# EAGLE design ble113_breakout_board_v20 (EAGLE 7.7.0)
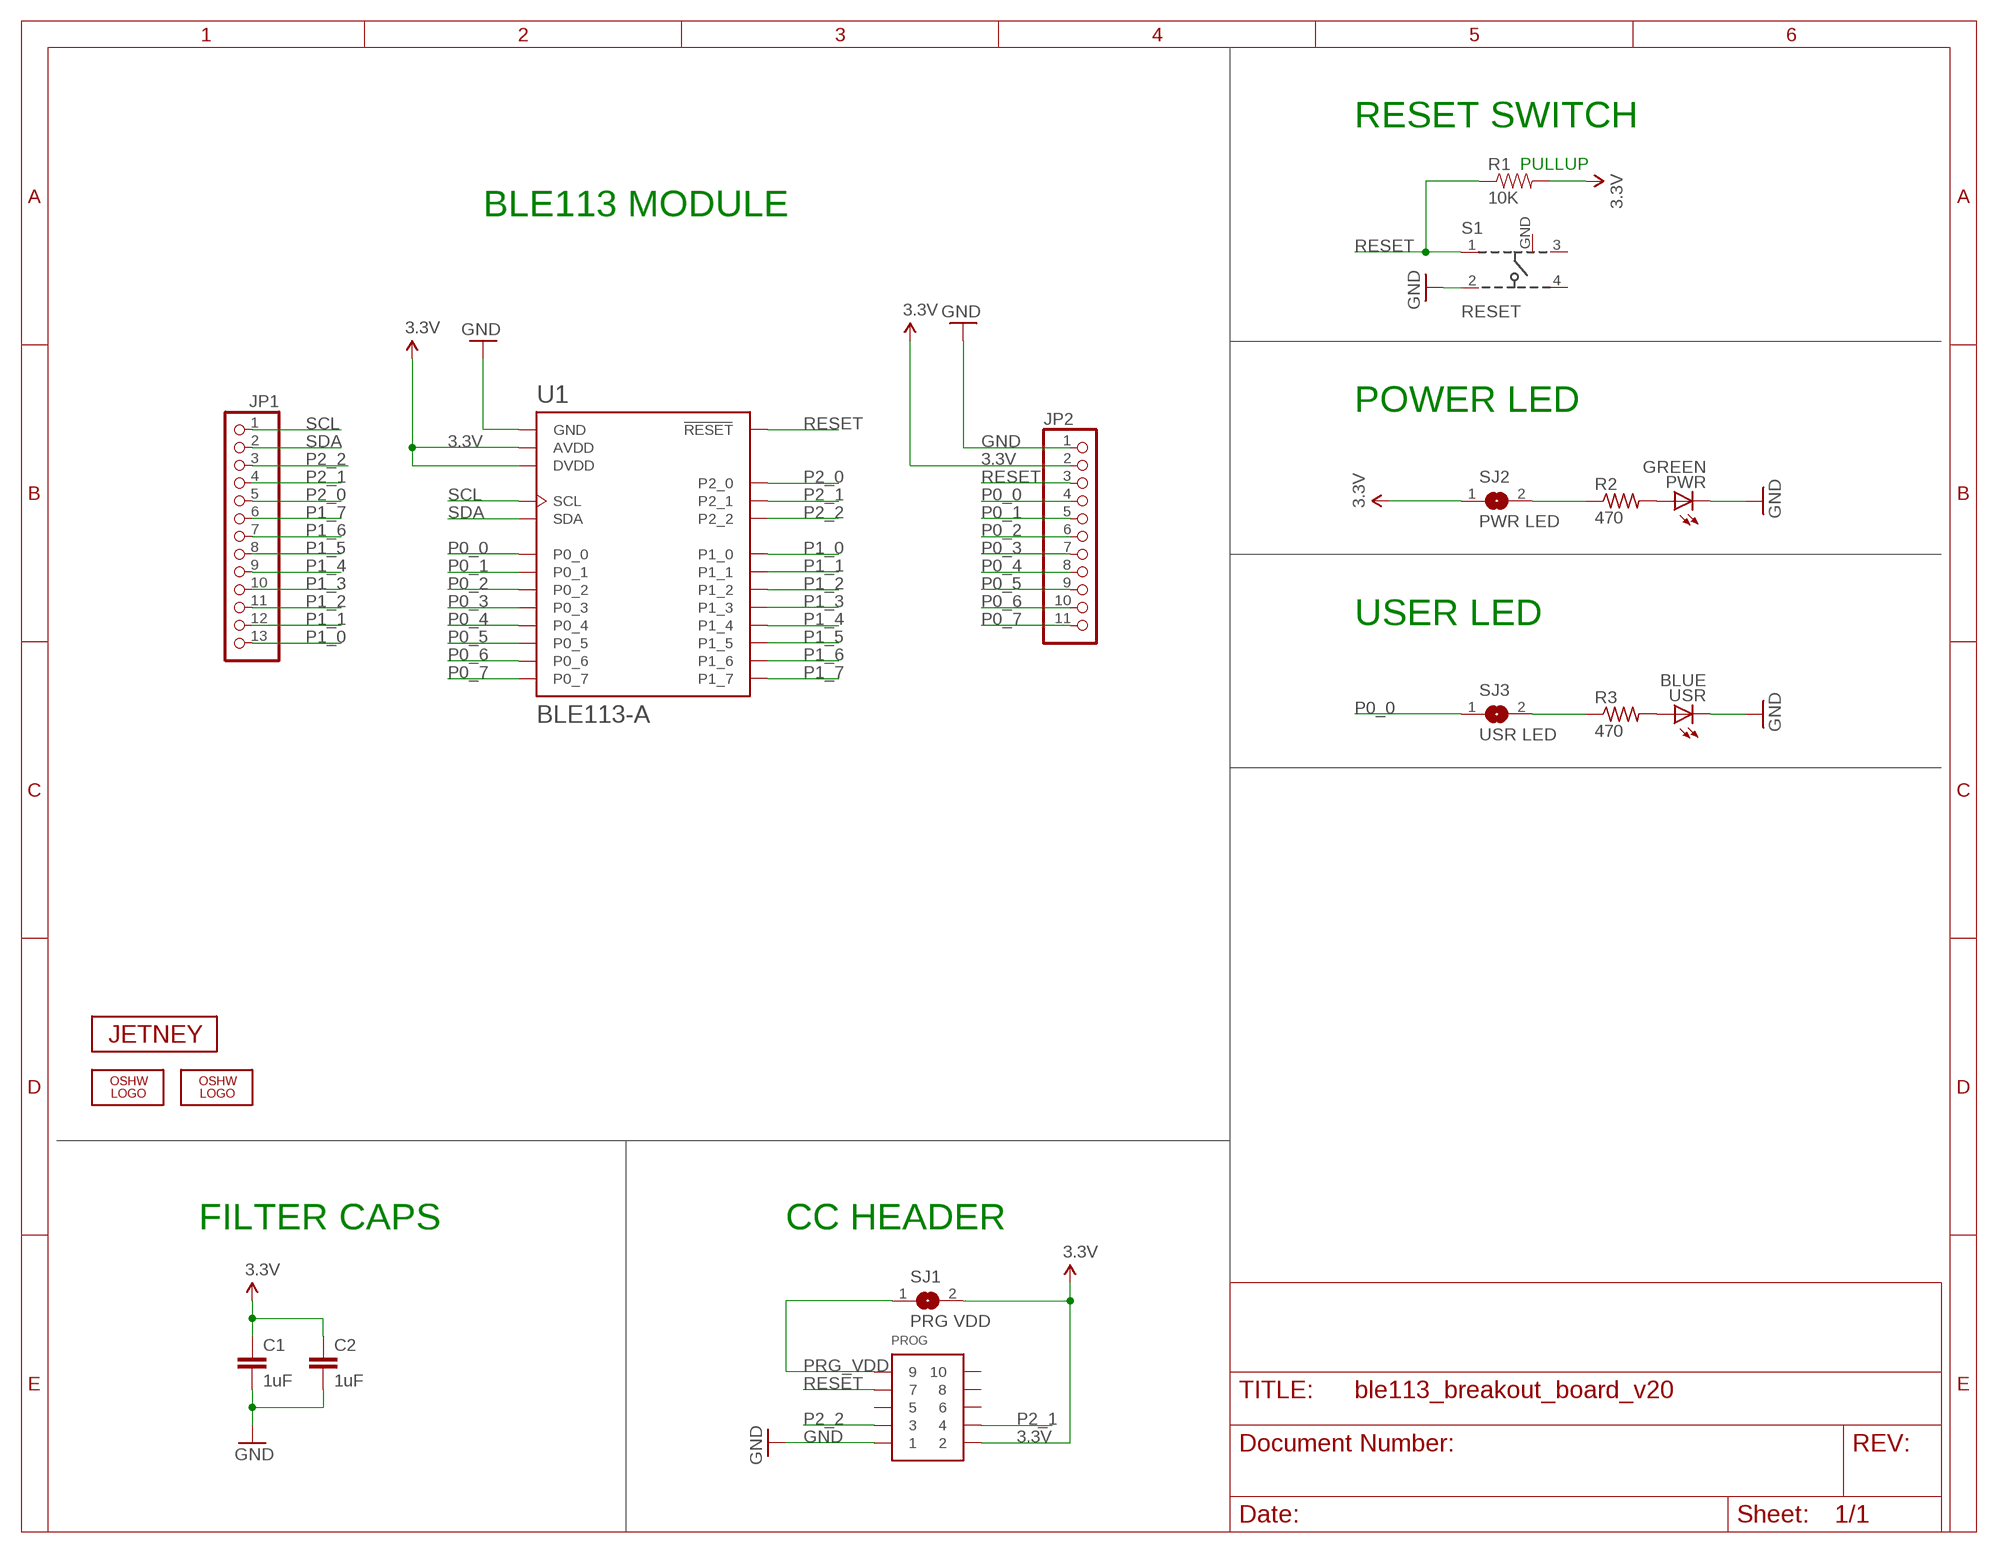
[diagram p0: schematic, sheet 1]

## Parts
C1  1uF  CAP0603-CAP  [0603-CAP]
C2  1uF  CAP0603-CAP  [0603-CAP]
JP1  PINHD-1X13  [1X13]
JP2  PINHD-1X11  [1X11]
LOGO1  OSHW_LOGO_FILLX0100-NT  [OSHW_FILLX100_NOTEXT]
LOGO2  OSHW_LOGO_FILLX0070-NT  [OSHW_FILLX70_NOTEXT]
PROG  CONN_5-2-FTSH-V  [FTSH-105-DV]
PWR  GREEN  LEDCHIPLED_0805  [CHIPLED_0805]
R1  10K  RESISTOR0603-RES  [0603-RES]
R2  470  R-US_R0603  [R0603]
R3  470  R-US_R0603  [R0603]
S1  RESET  101-IG  [101-IG]
SJ1  PRG VDD  SJ  [SJ]
SJ2  PWR LED  SJ  [SJ]
SJ3  USR LED  SJ  [SJ]
U1  BLE113-A  [BLE113-A]
U$2  JETNEY-LOGO-12  [JETNEY-LOGO-12]
USR  BLUE  LEDCHIPLED_0805  [CHIPLED_0805]

## Nets
3.3V [power]: C1.1 C2.1 JP2.2 PROG.2 R1.2 SJ1.2 SJ2.1 U1.AVDD U1.DVDD
GND [power]: C1.2 C2.2 JP2.1 PROG.1 PWR.C S1.2 U1.GND U1.GND@2(GND) U1.GND@3(GND) U1.GND@4(GND) U1.GND@5(GND) U1.GND@6(GND) U1.GND@7(GND) U1.GND@8(GND) U1.GND@9(GND) U1.GND@10(GND) USR.C
N$1: PWR.A R2.2
N$3 [power]: R2.1 SJ2.2
N$4: R3.2 USR.A
N$5: R3.1 SJ3.2
P0_0: JP2.4 SJ3.1 U1.P0_0
P0_1: JP2.5 U1.P0_1
P0_2: JP2.6 U1.P0_2
P0_3: JP2.7 U1.P0_3
P0_4: JP2.8 U1.P0_4
P0_5: JP2.9 U1.P0_5
P0_6: JP2.10 U1.P0_6
P0_7: JP2.11 U1.P0_7
P1_0: JP1.13 U1.P1_0
P1_1: JP1.12 U1.P1_1
P1_2: JP1.11 U1.P1_2
P1_3: JP1.10 U1.P1_3
P1_4: JP1.9 U1.P1_4
P1_5: JP1.8 U1.P1_5
P1_6: JP1.7 U1.P1_6
P1_7: JP1.6 U1.P1_7
P2_0: JP1.5 U1.P2_0
P2_1: JP1.4 PROG.4 U1.P2_1
P2_2: JP1.3 PROG.3 U1.P2_2
PRG_VDD [power]: PROG.9 SJ1.1
RESET: JP2.3 PROG.7 R1.1 S1.1 U1.RESET
SCL: JP1.1 U1.SCL
SDA: JP1.2 U1.SDA
Unconnected: PROG.5 PROG.6 PROG.8 PROG.10 S1.3 S1.4

## Notes on the sheet
- RESET SWITCH
- PULLUP
- BLE113 MODULE
- POWER LED
- USER LED
- FILTER CAPS | CC HEADER

## Power pins joined to a net without a drawn wire
GND: S1.GND

## Library data of the parts
C1 C2 = SparkFun:CAP: Capacitor Standard 0603 ceramic capacitor, and 0.1" leaded capacitor.
JP1 = sf-pinhead:PINHD-1X13: PIN HEADER
JP2 = sf-pinhead:PINHD-1X11: PIN HEADER
LOGO1 LOGO2 = oshw-logo:OSHW_LOGO_FILL
PROG = pel_misc:CONN_5-2
PWR USR = led:LED: LED OSRAM: - CHIPLED LG R971, LG N971, LY N971, LG Q971, LY Q971, LO R971, LY R971 LH N974, LH R974 LS Q976, LO Q976, LY Q976 LO Q996 - Hyper CHIPLED LW Q18S LB Q993, LB Q99A, LB R99A - SideLED LS A670, LO A670, LY A670, LG A670, LP A670 LB A673, LV A673, LT A673, LW A673 LH A674 LY A675 LS A676, LA A676, LO A676, LY A676, LW A676 LS A679, LY A679, LG A679 - Hyper Micro SIDELED® LS Y876, LA Y876, LO Y876, LY Y876 LT Y87S - SmartLED LW L88C, LW L88S LB L89C, LB L89S, LG L890 LS L89K, LO L89K, LY L89K LS L896, LA L896, LO L896, LY L896 - TOPLED LS T670, LO T670, LY T670, LG T670, LP T670 LSG T670, LSP T670, LSY T670, LOP T670, LYG T670 LG T671, LOG T671, LSG T671 LB T673, LV T673, LT T673, LW T673 LH T674 LS T676, LA T676, LO T676, LY T676, LB T676, LH T676, LSB T676, LW T676 LB T67C, LV T67C, LT T67C, LS T67K, LO T67K, LY T67K, LW E67C LS E67B, LA E67B, LO E67B, LY E67B, LB E67C, LV E67C, LT E67C LW T67C LS T679, LY T679, LG T679 LS T770, LO T770, LY T770, LG T770, LP T770 LB T773, LV T773, LT T773, LW T773 LH T774 LS E675, LA E675, LY E675, LS T675 LS T776, LA T776, LO T776, LY T776, LB T776 LHGB T686 LT T68C, LB T68C - Hyper Mini TOPLED® LB M676 - Mini TOPLED Santana® LG M470 LS M47K, LO M47K, LY M47K Source: http://www.osram.convergy.de LUXEON: - LUMILED® LXK2-PW12-R00, LXK2-PW12-S00, LXK2-PW14-U00, LXK2-PW14-V00 LXK2-PM12-R00, LXK2-PM12-S00, LXK2-PM14-U00 LXK2-PE12-Q00, LXK2-PE12-R00, LXK2-PE12-S00, LXK2-PE14-T00, LXK2-PE14-U00 LXK2-PB12-K00, LXK2-PB12-L00, LXK2-PB12-M00, LXK2-PB14-N00, LXK2-PB14-P00, LXK2-PB14-Q00 LXK2-PR12-L00, LXK2-PR12-M00, LXK2-PR14-Q00, LXK2-PR14-R00 LXK2-PD12-Q00, LXK2-PD12-R00, LXK2-PD12-S00 LXK2-PH12-R00, LXK2-PH12-S00 LXK2-PL12-P00, LXK2-PL12-Q00, LXK2-PL12-R00 Source: www.luxeon.com KINGBRIGHT: KA-3528ASYC Source: www.kingbright.com
R1 = SparkFun:RESISTOR: Resistor Basic schematic elements and footprints for 0603, 1206, and PTH resistors.
R2 R3 = resistor:R-US_: RESISTOR, American symbol
S1 = sf-keyglove:101-IG
SJ1-SJ3 = jumper:SJ: SMD solder JUMPER
U1 = sf-bluegiga:BLE113: Bluetooth Low Energy single-mode module - Bluetooth 4.0 (CC2541). BLE113-A variant has an on-module ceramic chip antenna. BLE113-A variant includes keepout/restrict area. Antenna edge of the module should be flush up against the edge of the PCB. See datasheet for variant layout details. The BLE113 is a Bluetooth Smart module targeted for small and low-power sensors and accessories. It integrates all features required for a Bluetooth Smart application, including Bluetooth radio, software stack, and GATT-based profiles. The BLE113 Bluetooth Smart module can also host end-user applications, which means no external micro controller is required in size or price constrained devices. Moreover, it has flexible hardware interfaces to connect to different peripherals and sensors and can be powered directly from a standard 3V coin cell battery or a pair of AAA batteries. In the lowest power sleep mode it merely consumes 500 nA and will wake up within a few hundred microseconds. The BLE113 Bluetooth Smart module conusmer approximately 30% less power and is smaller than the BLE112 Bluetooth Smart Module. http://www.bluegiga.com/en-US/products/bluetooth-4.0-modules/ble113-bluetooth--smart-module https://github.com/jrowberg/sf-oshw Last updated 2014-01-04 by Jeff Rowberg <jeff@rowberg.net>; ANTENNA: On-module ceramic chip antenna
U$2 = sf-keyglove:JETNEY-LOGO

## Net classes
0 default: width 0.152 mm, drill 0.33 mm, clearance 0.152 mm
1 power: width 0.254 mm, drill 0.33 mm, clearance 0.152 mm

## Board
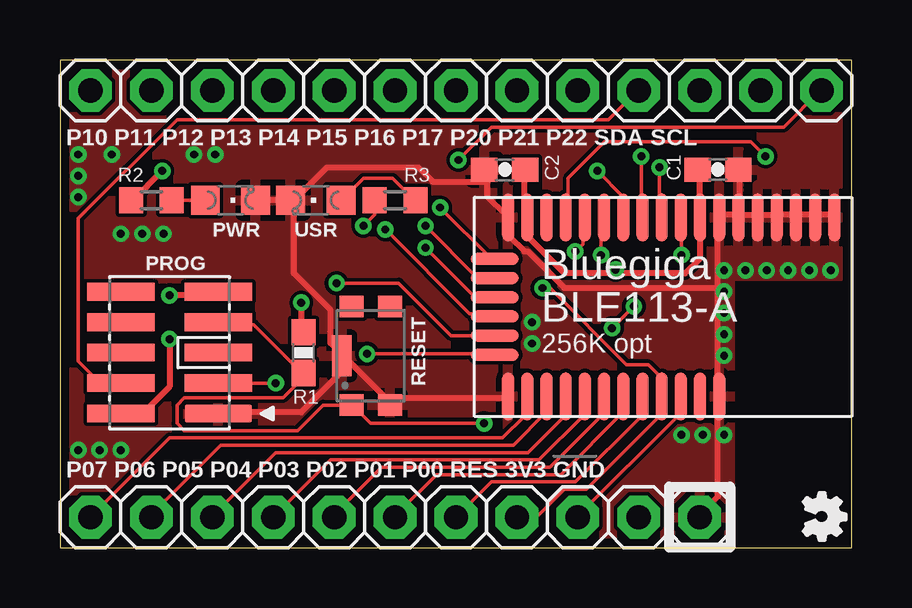
[diagram p1: board, top side]
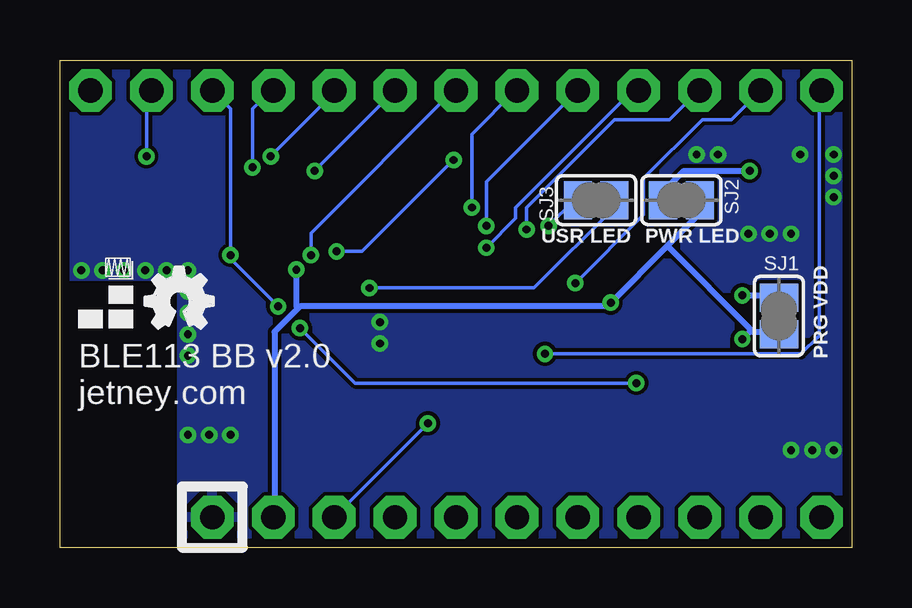
[diagram p2: board, bottom side, seen from below]

Size 33.02 x 20.32 mm. Coordinates in mm from the lower left corner, seen from the top.
Outline: 0,0 33.02,0 33.02,20.32 0,20.32 0,0
Copper layers (1*16): Top 0.0356mm / dielectric 1.5011mm / Bottom 0.0356mm
Design rules "default": minimum track width 6mil, minimum drill 13mil, track to track 6mil, track to pad 6mil, pad to pad 6mil, via to via 6mil, smd to smd 6mil, copper to edge 15mil, drill to drill 6mil, minimum pad ring 7mil, minimum via ring 7mil, stop-mask expansion 4mil, vias tented up to drill 13mil, thermal gap 10mil
vRestrict: area 0.3,16.8 to 32.8,17.5; area 0.3,2.8 to 27.9,3.7

### Footprints (pad centres in the part's own frame; a part is rotated, then mirrored left to right if it is on the bottom)
0603-CAP = smd 1.1 x 1: 1 -0.85,0; 2 0.85,0
1X13 = drill 1.016 pad 1.778 octagon: 1 -15.24,0; 2 -12.7,0; 3 -10.16,0; 4 -7.62,0; 5 -5.08,0; 6 -2.54,0; 7 0,0; 8 2.54,0; 9 5.08,0; 10 7.62,0; 11 10.16,0; 12 12.7,0; 13 15.24,0
1X11 = drill 1.016 pad 1.778 octagon: 1 -12.7,0; 2 -10.16,0; 3 -7.62,0; 4 -5.08,0; 5 -2.54,0; 6 0,0; 7 2.54,0; 8 5.08,0; 9 7.62,0; 10 10.16,0; 11 12.7,0
FTSH-105-DV = smd 0.74 x 2.8: 1 -2.54,-2.03; 2 -2.54,2.03; 3 -1.27,-2.03; 4 -1.27,2.03; 5 0,-2.03; 6 0,2.03; 7 1.27,-2.03; 8 1.27,2.03; 9 2.54,-2.03; 10 2.54,2.03
CHIPLED_0805 = smd 1.2 x 1.2: A 0,-1.05; C 0,1.05
0603-RES = smd 1.1 x 1: 1 -0.85,0; 2 0.85,0
R0603 = smd 1 x 1.1: 1 -0.85,0; 2 0.85,0
101-IG = smd 0.9 x 1: 1 -2.05,0.8; 2 -2.05,-0.8; 3 2.05,0.8; 4 2.05,-0.8 | smd 1.7 x 0.8: GND 0,1.2
SJ = smd 1.168 x 1.6: 1 -0.762,0; 2 0.762,0
BLE113-A = smd 2 x 0.5: AVDD -3.725,1.538; DVDD -3.725,-5.662; GND -3.725,7.138; GND@2 -3.725,6.338; GND@3 -3.725,5.537; GND@4 -3.725,4.737; GND@5 -3.725,3.938; GND@6 -3.725,3.138; GND@7 -3.725,2.337; GND@8 -3.725,-6.463; GND@9 3.725,-6.463; GND@10 3.725,2.337; NC -3.725,-4.862; NC@2 3.725,1.538; P0_0 3.725,-0.062; P0_1 3.725,-0.863; P0_2 3.725,-1.663; P0_3 3.725,-2.462; P0_4 3.725,-3.263; P0_5 3.725,-4.062; P0_6 3.725,-4.862; P0_7 3.725,-5.662; P1_6 -3.725,-2.462; P1_7 -3.725,-1.663; P2_0 -3.725,-0.863; P2_1 -3.725,-0.062; P2_2 -3.725,0.738; RESET 3.725,0.738; SCL -3.725,-3.263; SDA -3.725,-4.062 | smd 0.5 x 2: P1_0 2,-7.013; P1_1 1.2,-7.013; P1_2 0.4,-7.013; P1_3 -0.4,-7.013; P1_4 -1.2,-7.013; P1_5 -2,-7.013

### Placement (x,y rotation side)
C1  27.43,15.75 0 top
C2  18.54,15.75 180 top
JP1  16.51,19.05 180 top
JP2  13.97,1.27 180 top
LOGO1  29.46,9.14 0 bottom
LOGO2  30.99,2.29 270 top
PROG  4.57,8.13 90 top
PWR  7.11,14.48 270 top
R1  10.16,8.13 90 top
R2  3.81,14.48 0 top
R3  13.97,14.48 0 top
S1  12.95,8 90 top
SJ1  3.05,9.65 270 bottom
SJ2  7.11,14.48 180 bottom
SJ3  10.67,14.48 180 bottom
U1  25.15,10.03 270 top
U$2  32.26,9.14 0 bottom
USR  10.67,14.48 90 top

### Tracks (layer width: path | path; a pad name or v marks a point on that pad's centre or on a via)
3.3V  (via drill 0.33)
  Top 0.254: C2.1 19.36,15.7 19.36,13.87 U1.DVDD 19.51,13.72 19.51,12.95 21.03,11.43 23.16,11.43 | C1.1 26.67,15.7 26.67,13.87 U1.AVDD 26.67,13.72 26.67,12.04 26.06,11.43 23.16,11.43 | v10.06,10.21 10.06,8.99 R1.2 | v4.57,8.69 4.57,6.71 3.5,5.64 2.59,5.64 PROG.2 | v23.16,11.58 23.16,11.43
  Bottom 0.254: 7.7,12.57 6.4,13.87 6.4,14.48 SJ2.1 | 7.7,12.57 v10.06,10.21 10.21,10.06 23.01,10.06 23.09,9.98 | 7.7,12.57 4.19,9.07 | 4.19,9.07 4.12,8.99 3.05,8.99 SJ1.2 | 4.19,9.07 v4.57,8.69 | 23.09,9.98 24.08,8.99 24.08,1.37 JP2.2 | v23.16,11.58 23.16,10.06 23.09,9.98
GND  (via drill 0.33)
  Top 0.254: 32.31,13.87 U1.GND 32.16,13.87 31.55,13.87 U1.GND@2 31.39,13.87 30.79,13.87 U1.GND@3 30.63,13.87 30.02,13.87 U1.GND@4 29.87,13.87 29.11,13.87 U1.GND@5 28.96,13.87 28.35,13.87 | 27.43,13.87 U1.GND@7 | 28.35,13.87 28.35,15.7 C1.2 | U1.GND@7 27.58,13.87 28.19,13.87 U1.GND@6 28.35,13.87 | JP2.1 26.67,1.37 27.43,2.13 27.43,6.25 U1.GND@10 27.43,6.4 27.43,10.82 | 27.43,10.82 27.43,13.72 U1.GND@7 | 17.83,15.24 17.83,14.63 18.59,13.87 U1.GND@8 | 17.83,15.24 17.83,15.7 C2.2 | 18.75,13.87 U1.GND@8 | 18.75,6.4 U1.GND@9 18.59,6.25 13.72,6.25 S1.2 13.72,6.1 11.89,7.92 S1.GND | PWR.C USR.C 9.75,14.48 | 9.75,14.48 9.75,11.43 11.28,9.91 11.28,8.53 11.73,8.08 S1.GND | 17.83,15.24 15.54,15.24 14.94,15.85 11.12,15.85 9.75,14.48 | PROG.1 6.71,5.64 10.06,5.64 12.04,7.62 S1.GND | 27.43,10.82 21.03,10.82 19.51,12.34 19.36,12.34 18.75,12.95 18.75,13.72 U1.GND@8
  other vias: 32.13,11.56 31.24,11.56 30.35,11.56 29.46,11.56 28.57,11.56 27.69,11.56 27.69,10.67 27.69,9.78 27.69,8.89 27.69,8 27.69,4.7 26.8,4.7 25.91,4.7 0.76,16.38 0.76,15.49 0.76,14.61 2.16,16.38 5.59,16.38 6.48,16.38 19.68,9.4 19.68,8.51 0.76,4.06 1.65,4.06 2.54,4.06 2.54,13.08 3.43,13.08 4.32,13.08
  pour Bottom: 0,20.32 33.02,20.32 33.02,6.35 27.94,6.35 27.94,0 0,0
  pour Top: 0,20.32 33.02,20.32 33.02,6.35 27.94,6.35 27.94,0 0,0
N$1
  Top 0.152: PWR.A R2.2
N$3  (via drill 0.33)
  Top 0.254: v4.27,15.7 3.05,14.48 R2.1
  Bottom 0.254: v4.27,15.7 7.01,15.7 7.77,14.94 7.77,14.48 SJ2.2
N$4
  Top 0.152: R3.2 14.78,14.48 13.87,15.39 12.65,15.39 11.73,14.48 USR.A
N$5  (via drill 0.33)
  Top 0.152: v12.65,13.41 13.11,13.87 13.11,14.48 R3.1
  Bottom 0.152: v12.65,13.41 11.58,14.48 SJ3.2
N$6
  Bottom 0.152: 6.6,14.48 7.62,14.48
N$8
  Bottom 0.152: 10.16,14.48 11.18,14.48
N$9
  Bottom 0.152: 3.05,9.14 3.05,10.16
P0_0  (via drill 0.33)
  Top 0.152: v20.12,10.82 20.42,10.82 23.62,7.62 24.54,7.62 24.99,7.16 24.99,6.4 U1.P0_0 24.99,6.25 24.99,5.49 21.95,2.44 21.03,2.44 19.96,1.37 19.05,1.37 JP2.4
  Bottom 0.152: SJ3.1 9.91,14.17 13.26,10.82 v20.12,10.82
P0_1
  Top 0.152: JP2.5 17.98,2.74 21.49,2.74 24.23,5.49 24.23,6.25 U1.P0_1
P0_2
  Top 0.152: U1.P0_2 23.47,6.25 23.47,5.64 20.88,3.05 15.7,3.05 14.02,1.37 JP2.6
P0_3
  Top 0.152: U1.P0_3 22.55,6.25 22.55,5.49 20.42,3.35 13.41,3.35 11.43,1.37 JP2.7
P0_4
  Top 0.152: JP2.8 11.28,3.66 19.96,3.66 21.79,5.49 21.79,6.25 U1.P0_4
P0_5
  Top 0.152: U1.P0_5 21.03,6.25 21.03,5.49 19.51,3.96 8.99,3.96 6.4,1.37 JP2.9
P0_6
  Top 0.152: U1.P0_6 20.27,6.25 20.27,5.64 18.9,4.27 6.71,4.27 3.81,1.37 JP2.10
P0_7
  Top 0.152: JP2.11 4.57,4.57 18.44,4.57 19.36,5.49 19.36,6.25 U1.P0_7
P1_0  (via drill 0.33)
  Top 0.152: v12.8,8.08 17.98,8.08 U1.P1_0
  Bottom 0.152: v12.8,8.08 2.13,8.08 1.37,8.84 1.37,19.05 JP1.13
P1_1  (via drill 0.33)
  Top 0.152: v11.53,11.02 14.12,11.02 16.31,8.84 17.98,8.84 U1.P1_1
  Bottom 0.152: v11.53,11.02 8.69,13.87 8.69,15.39 6.25,17.83 5.03,17.83 JP1.12
P1_2  (via drill 0.33)
  Top 0.152: v13.56,13.26 17.07,9.75 17.98,9.75 U1.P1_2
  Bottom 0.152: v13.56,13.26 13.56,14.17 9.91,17.83 7.62,17.83 6.4,19.05 JP1.11
P1_3  (via drill 0.33)
  Top 0.152: v15.24,12.5 17.22,10.52 17.98,10.52 U1.P1_3
  Bottom 0.152: v15.24,12.5 14.02,13.72 14.02,14.17 9.14,19.05 JP1.10
P1_4  (via drill 0.33)
  Top 0.152: v15.24,13.41 17.37,11.28 17.98,11.28 U1.P1_4
  Bottom 0.152: v15.24,13.41 15.24,15.24 JP1.9
P1_5  (via drill 0.33)
  Top 0.152: v15.85,14.17 17.98,12.04 U1.P1_5
  Bottom 0.152: v15.85,14.17 15.85,17.22 14.02,19.05 JP1.8
P1_6  (via drill 0.33)
  Top 0.152: v22.55,12.19 22.55,13.72 U1.P1_6
  Bottom 0.152: v22.55,12.19 22.55,13.11 16.61,19.05 JP1.7
P1_7  (via drill 0.33)
  Top 0.152: v22.4,15.7 23.47,14.63 23.47,13.87 U1.P1_7
  Bottom 0.152: JP1.6 v22.4,15.7
P2_0  (via drill 0.33)
  Top 0.152: v24.23,16.31 24.23,13.87 U1.P2_0
  Bottom 0.152: v24.23,16.31 21.49,19.05 JP1.5
P2_1  (via drill 0.33)
  Top 0.152: v24.99,15.85 24.99,13.87 U1.P2_1 | PROG.4 1.68,6.86 0.76,7.77 0.76,13.72 4.88,17.83 22.86,17.83 24.08,19.05 JP1.4
  Bottom 0.152: v24.99,15.85 24.99,18.29 24.23,19.05 JP1.4
P2_2  (via drill 0.33)
  Top 0.152: v25.91,12.19 25.91,13.72 U1.P2_2 | v8.99,6.86 PROG.3 | v23.93,10.06 v23.01,9.14
  Bottom 0.152: JP1.3 25.91,18.29 v25.91,12.19 25.91,12.04 v23.93,10.06 | v8.99,6.86 20.73,6.86 v23.01,9.14
PRG_VDD  (via drill 0.33)
  Top 0.254: v4.57,10.52 6.4,10.52 6.55,10.67 PROG.9
  Bottom 0.254: v4.57,10.52 3.05,10.52 SJ1.1
RESET  (via drill 0.33)
  Top 0.152: PROG.7 6.71,9.3 8.08,9.3 10.06,7.32 R1.1 10.21,7.16 9.3,6.25 5.18,6.25 4.88,5.94 4.88,5.18 5.18,4.88 9.91,4.88 10.97,5.94 12.04,5.94 S1.1 12.19,5.94 12.95,5.18 v17.68,5.18 | U1.RESET 25.76,6.25 25.76,5.49 21.64,1.37 JP2.3
  Bottom 0.152: JP2.3 v17.68,5.18
SCL  (via drill 0.33)
  Top 0.152: v21.49,12.34 21.79,12.65 21.79,13.72 U1.SCL | v16.61,16.15 17.98,17.53 30.18,17.53 31.7,19.05 JP1.1
  Bottom 0.152: v21.49,12.34 20.42,12.34 v16.61,16.15
SDA  (via drill 0.33)
  Top 0.152: v29.41,16.31 28.8,16.92 22.71,16.92 21.18,15.39 21.18,13.87 U1.SDA
  Bottom 0.152: v29.41,16.31 29.41,18.9 29.26,19.05 JP1.2

### Text on the board
tPlace: P10 P11 P12 P13 P14 P15 P16 P17 P20 P21 P22 SDA SCL | Bluegiga | BLE113-A | 256K opt | RESET | P07 P06 P05 P04 P03 P02 P01 P00 RES 3V3 GND
bPlace: PWR LED | USR LED | PRG VDD | BLE113 BB v2.0 | jetney.com